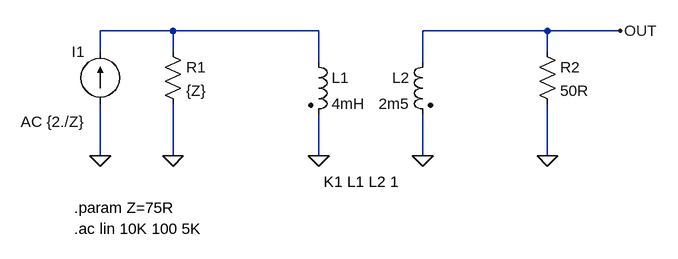
[diagram p0: schematic transformer.asc]
transformer.asc, the LTspice schematic file:
Version 4
SHEET 1 1624 680
WIRE -32 96 -144 96
WIRE 192 96 -32 96
WIRE 544 96 352 96
WIRE 656 96 544 96
WIRE -144 128 -144 96
WIRE -32 128 -32 96
WIRE 544 128 544 96
WIRE 192 144 192 96
WIRE 352 144 352 96
WIRE -144 288 -144 208
WIRE -32 288 -32 208
WIRE 192 288 192 224
WIRE 352 288 352 224
WIRE 544 288 544 208
FLAG -32 288 0
FLAG 544 288 0
FLAG -144 288 0
FLAG 656 96 OUT
FLAG 192 288 0
FLAG 352 288 0
SYMBOL res -48 112 R0
SYMATTR InstName R1
SYMATTR Value {Z}
SYMBOL res 528 112 R0
SYMATTR InstName R2
SYMATTR Value 50R
SYMBOL current -144 208 R180
WINDOW 0 24 80 Left 2
WINDOW 3 24 0 Left 2
WINDOW 123 24 -28 Left 2
WINDOW 39 0 0 Left 0
SYMATTR InstName I1
SYMATTR Value ""
SYMATTR Value2 AC {2./Z}
SYMBOL ind2 176 128 R0
SYMATTR InstName L1
SYMATTR Value 4mH
SYMBOL ind2 368 128 M0
SYMATTR InstName L2
SYMATTR Value 2m5
TEXT -184 400 Left 2 !.ac lin 10K 100 5K
TEXT -184 368 Left 2 !.param Z=75R
TEXT 200 328 Left 2 !K1 L1 L2 1

The netlist it stands for:
* transformer.asc
R1 N001 0 {Z}
R2 OUT 0 50R
I1 0 N001 AC {2./Z}
L1 N001 0 4mH
L2 OUT 0 2m5
.ac lin 10K 100 5K
.param Z=75R
K1 L1 L2 1
.backanno
.end